# EAGLE design PayloadStandingV25 (EAGLE 9.0.0)
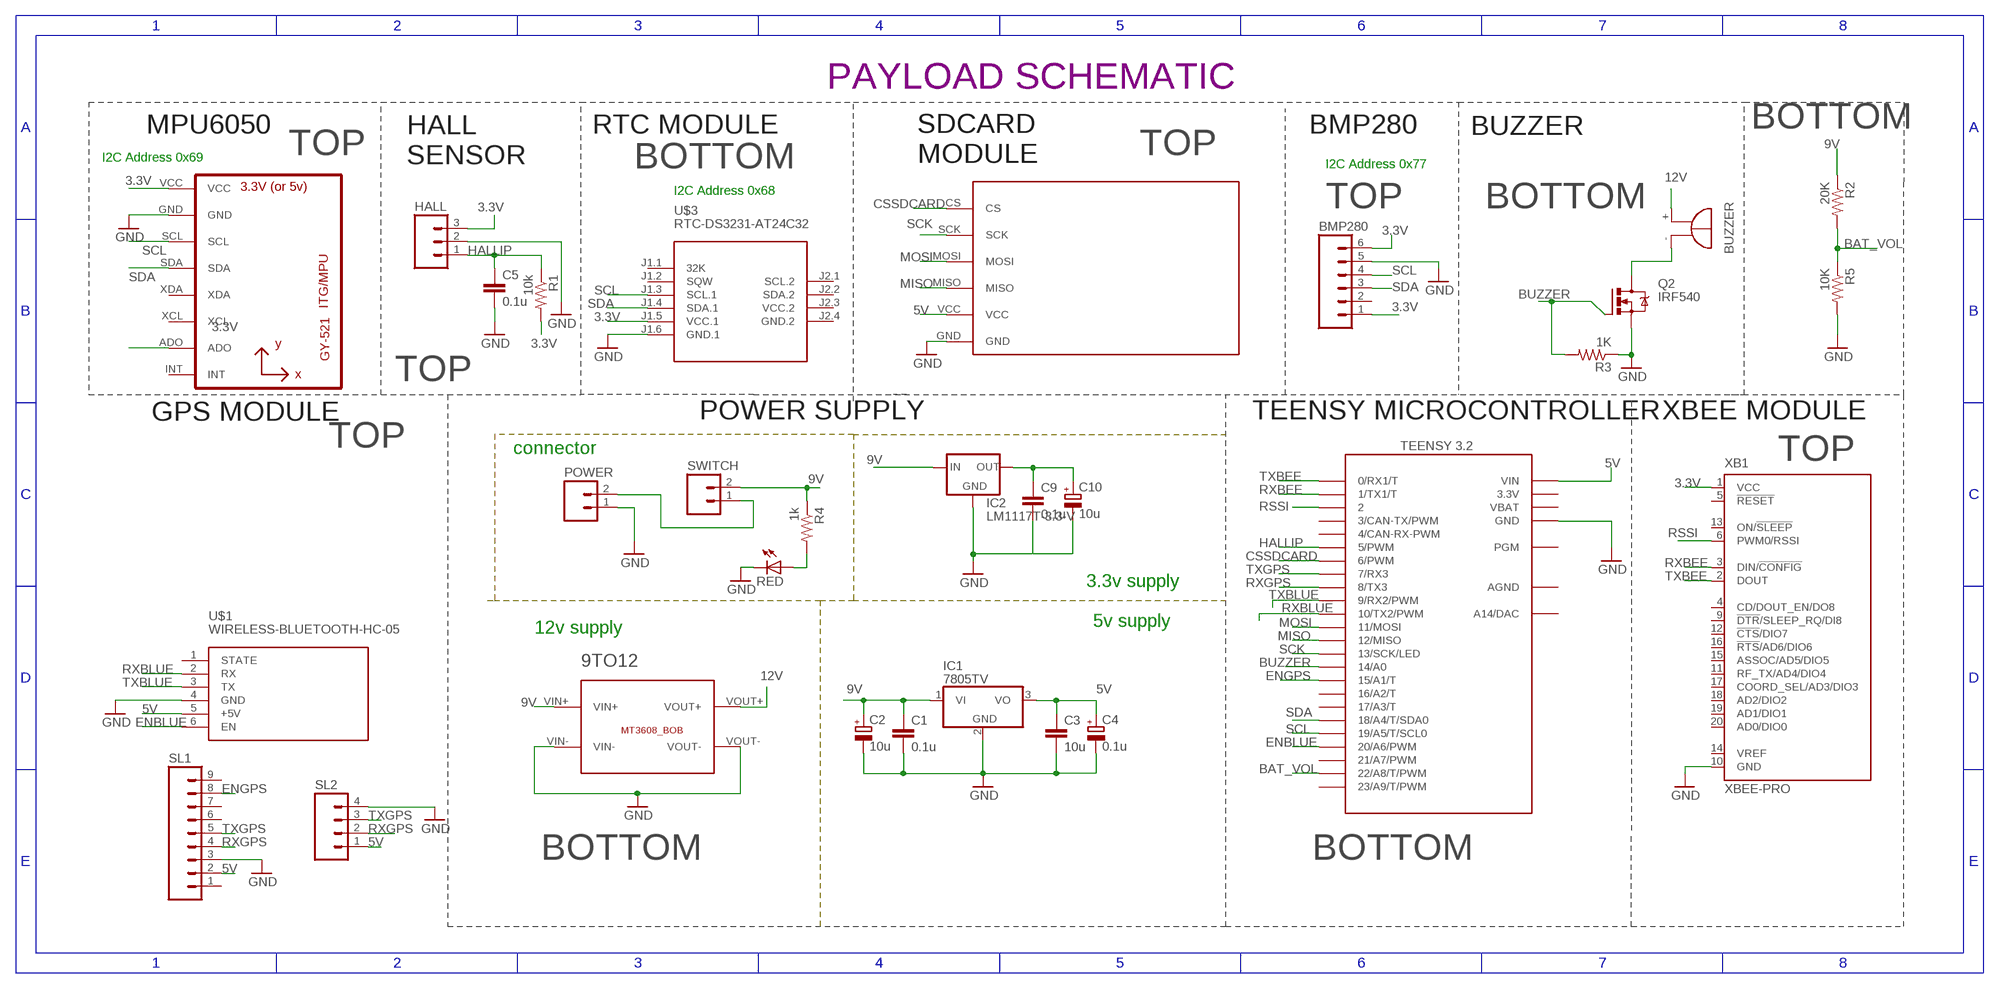
[diagram p0: schematic, sheet 1]

## Parts
9TO12  BREAKOUTS_MT3608_BOB  [BREAKOUTS_MT3608_BOB]
BMP280  M06  [06P]
C1  0.1u  C-EU025-025X050  [C025-025X050]
C2  10u  CPOL-EUE2.5-6  [E2,5-6]
C3  10u  C-EU025-025X050  [C025-025X050]
C4  0.1u  CPOL-EUE2.5-6  [E2,5-6]
C5  0.1u  C-EU025-025X050  [C025-025X050]
C9  0.1u  C-EU025-025X050  [C025-025X050]
C10  10u  CPOL-EUE2.5-6  [E2,5-6]
HALL  M03  [03P]
IC1  7805TV  [TO220V]
IC2  LM1117T-3.3-V  [TO220V]
POWER  CEDT_JANUARY_2015_V5_M02  [CEDT_JANUARY_2015_V5_02P]
Q2  IRF540  [TO220BV]
R1  10k  R-US_0204/7  [0204/7]
R2  20K  R-US_0204/7  [0204/7]
R3  1K  R-US_0204/7  [0204/7]
R4  1k  R-US_0204/7  [0204/7]
R5  10K  R-US_0204/7  [0204/7]
RED  red  LED3MM  [LED3MM]
SG1  BUZZER_EB2209A  [BUZZER_EB2209A]
SL1  M09  [09P]
SL2  CON-AMP-QUICK_M04  [CON-AMP-QUICK_04P]
SWITCH  M02  [02P]
U1  GY-521MPU6050  [GY-521]
U$1  WIRELESS-BLUETOOTH-HC-05  [WIRELESS-BLUETOOTH-HC-05]
U$2  TEENSY_3.1-3.2_OUTER_ROW  [TEENSY_3.0-3.2&LC_OUTER_ROW]
U$3  RTC-DS3231-AT24C32  [RTC-DS3231-AT24C32]
U$5  SDCARD  [M0SDCARDMODULE]
XB1  XBEE-PRO  [XBEE-PRO]

## Nets
3.3V [power]: BMP280.1 BMP280.6 C9.1 C10.+ HALL.3 IC2.2(OUT) R1.2 U1.ADO U1.VCC U$3.J1.5(VCC.1) XB1.1(VCC)
5V [power]: C3.1 C4.+ IC1.3(VO) SL1.2 SL2.1 U$1.5(+5V) U$2.VIN U$5.VCC
9V [power]: 9TO12.VIN+ C1.1 C2.+ IC1.1(VI) IC2.3(IN) R2.1 R4.1 SWITCH.2
12V [power]: 9TO12.VOUT+ SG1.+
BAT_VOL: R2.2 R5.1 U$2.22/A8(22/A8/T/PWM)
BUZZER: Q2.G R3.2 U$2.14/A0
CSSDCARD: U$2.6(6/PWM) U$5.CS
ENBLUE: U$1.6(EN) U$2.20/A6(20/A6/PWM)
ENGPS: SL1.8 U$2.15/A1(15/A1/T)
GND [power]: 9TO12.VIN- 9TO12.VOUT- BMP280.5 C1.2 C2.- C3.2 C4.- C5.2 C9.2 C10.- HALL.2 IC1.2(GND) IC2.1(GND) POWER.1 Q2.S R3.1 R5.2 RED.K(C) SL1.3 SL2.4 U1.GND U$1.4(GND) U$2.GND U$2.GND1(GND) U$3.J1.6(GND.1) U$5.GND XB1.10(GND)
HALLIP: C5.1 HALL.1 R1.1 U$2.5(5/PWM)
MISO: U$2.12(12/MISO) U$5.MISO
MOSI: U$2.11(11/MOSI) U$5.MOSI
N$1 [power]: POWER.2 SWITCH.1
N$2: R4.2 RED.A
N$3 [power]: Q2.D SG1.-
RSSI: U$2.2 XB1.6(PWM0/RSSI)
RXBEE: U$2.1(1/TX1/T) XB1.3(DIN/!CONFIG)
RXBLUE: U$1.2(RX) U$2.10(10/TX2/PWM)
RXGPS: SL1.4 SL2.2 U$2.8(8/TX3)
SCK: U$2.13(13/SCK/LED) U$5.SCK
SCL: BMP280.4 U1.SCL U$2.19/A5(19/A5/T/SCL0) U$3.J1.3(SCL.1)
SDA: BMP280.3 U1.SDA U$2.18/A4(18/A4/T/SDA0) U$3.J1.4(SDA.1)
TXBEE: U$2.0(0/RX1/T) XB1.2(DOUT)
TXBLUE: U$1.3(TX) U$2.9(9/RX2/PWM)
TXGPS: SL1.5 SL2.3 U$2.7(7/RX3)
Unconnected: BMP280.2 SL1.1 SL1.6 SL1.7 SL1.9 U1.INT U1.XCL U1.XDA U$1.1(STATE) U$2.3(3/CAN-TX/PWM) U$2.4(4/CAN-RX-PWM) U$2.16/A2(16/A2/T) U$2.17/A3(17/A3/T) U$2.21/A7(21/A7/PWM) U$2.23/A9(23/A9/T/PWM) U$2.PGM U$2.RESET/DAC(A14/DAC) U$3.J1.1(32K) U$3.J1.2(SQW) U$3.J2.1(SCL.2) U$3.J2.2(SDA.2) XB1.4(CD/DOUT_EN/DO8) XB1.5(!RESET) XB1.9(!DTR!/SLEEP_RQ/DI8) XB1.11(RF_TX/AD4/DIO4) XB1.12(!CTS!/DIO7) XB1.13(ON/!SLEEP) XB1.14(VREF) XB1.15(ASSOC/AD5/DIO5) XB1.16(!RTS!/AD6/DIO6) XB1.17(COORD_SEL/AD3/DIO3) XB1.18(AD2/DIO2) XB1.19(AD1/DIO1) XB1.20(AD0/DIO0)

## Notes on the sheet
- PAYLOAD SCHEMATIC
- MPU6050 | RTC MODULE | BMP280 | BUZZER | BOTTOM
- TOP | TOP
- I2C Address 0x69
- SDCARD
  MODULE
- HALL
  SENSOR
- BOTTOM | I2C Address 0x77
- I2C Address 0x68
- TOP | BOTTOM
- TOP
- GPS MODULE | POWER SUPPLY | TEENSY MICROCONTROLLER | XBEE MODULE
- TOP
- connector
- TOP
- 3.3v supply
- 5v supply
- 12v supply
- BOTTOM | BOTTOM

## Power pins joined to a net without a drawn wire
3.3V: U$2.3.3V U$2.3.3V1(3.3V)
AGND: U$2.AGND
GND.2: U$3.J2.4(GND.2)
VBAT: U$2.VBAT
VCC.2: U$3.J2.3(VCC.2)

## Library data of the parts
9TO12 = Cansat2019_3279_Container_v01:BREAKOUTS_MT3608_BOB
BMP280 = con-amp-quick:M06: AMP QUICK CONNECTOR; OC_FARNELL: unknown; OC_NEWARK: unknown
C1 C3 C5 C9 = resistor:C-EU: CAPACITOR, European symbol
C2 C4 C10 = rcl:CPOL-EU: POLARIZED CAPACITOR, European symbol; SPICEPREFIX: C
HALL = con-amp-quick:M03: AMP QUICK CONNECTOR; OC_FARNELL: unknown; OC_NEWARK: unknown
IC1 = linear:78*: Positive VOLTAGE REGULATOR Source: http://cache.national.com/ds/LM/LM78L05.pdf http://www.fairchildsemi.com/ds/LM/LM7805.pdf
IC2 = lm1117:LM1117T-*
POWER = Cansat2019_3279_Container_v01:CEDT_JANUARY_2015_V5_M02: AMP QUICK CONNECTOR
Q2 = transistor-power:IRF540: HEXFET Power MOSFET
R1-R5 = rcl:R-US_: RESISTOR, American symbol; SPICEPREFIX: R
RED = CEDT_JANUARY_2015_v5:LED
SG1 = Cansat2019_3279_Container_v01:BUZZER_EB2209A: BUZZER Source: Buerklin; OC_FARNELL: unknown; OC_NEWARK: unknown
SL1 = con-amp-quick:M09: AMP QUICK CONNECTOR; OC_FARNELL: unknown; OC_NEWARK: unknown
SL2 = ADC_CPLDV8:CON-AMP-QUICK_M04: AMP QUICK CONNECTOR; OC_FARNELL: unknown; OC_NEWARK: unknown
SWITCH = CEDT_JANUARY_2015_v5:M02: AMP QUICK CONNECTOR
U1 = gy-521:GY-521
U$1 = diy-modules(1):WIRELESS-BLUETOOTH-HC-05: Bluetooth Transceiver Module based on HC-05 board Tutorial is available here: https://arduino-info.wikispaces.com/BlueTooth-HC05-HC06-Modules-How-To Click here to find device on ebay.com <http://www.ebay.com/sch/hc-05+module+rs232>
U$2 = Teensy_3_and_LC_Series_Boards_v1.4:TEENSY_3.1-3.2_OUTER_ROW: Footprint for Teensy 3.1 or 3.2 board using all pin connections on the outer perimeter
U$3 = diy-modules:RTC-DS3231-AT24C32: RTC Module with Battery and EEPROM based on DS3231 and AT24C32 chips Tutorial can be found here: https://edwardmallon.wordpress.com/2014/05/21/using-a-cheap-3-ds3231-rtc-at24c32-eeprom-from-ebay/ Click here to find device on ebay.com <http://www.ebay.com/sch/DS3231+AT24C32+module>
U$5 = mylib:SDCARD
XB1 = maxstream:XBEE: XBee (TM) /XBee-PRO(TM) OEM RF Modules Source: MaxStream, Inc. xbee_productmanual.pdf; MPN: XBP24-AWI-001; OC_FARNELL: 1337916; OC_NEWARK: 42M2667

## Net classes
0 default: width 0.61 mm
1 power: width 0.61 mm

## Board
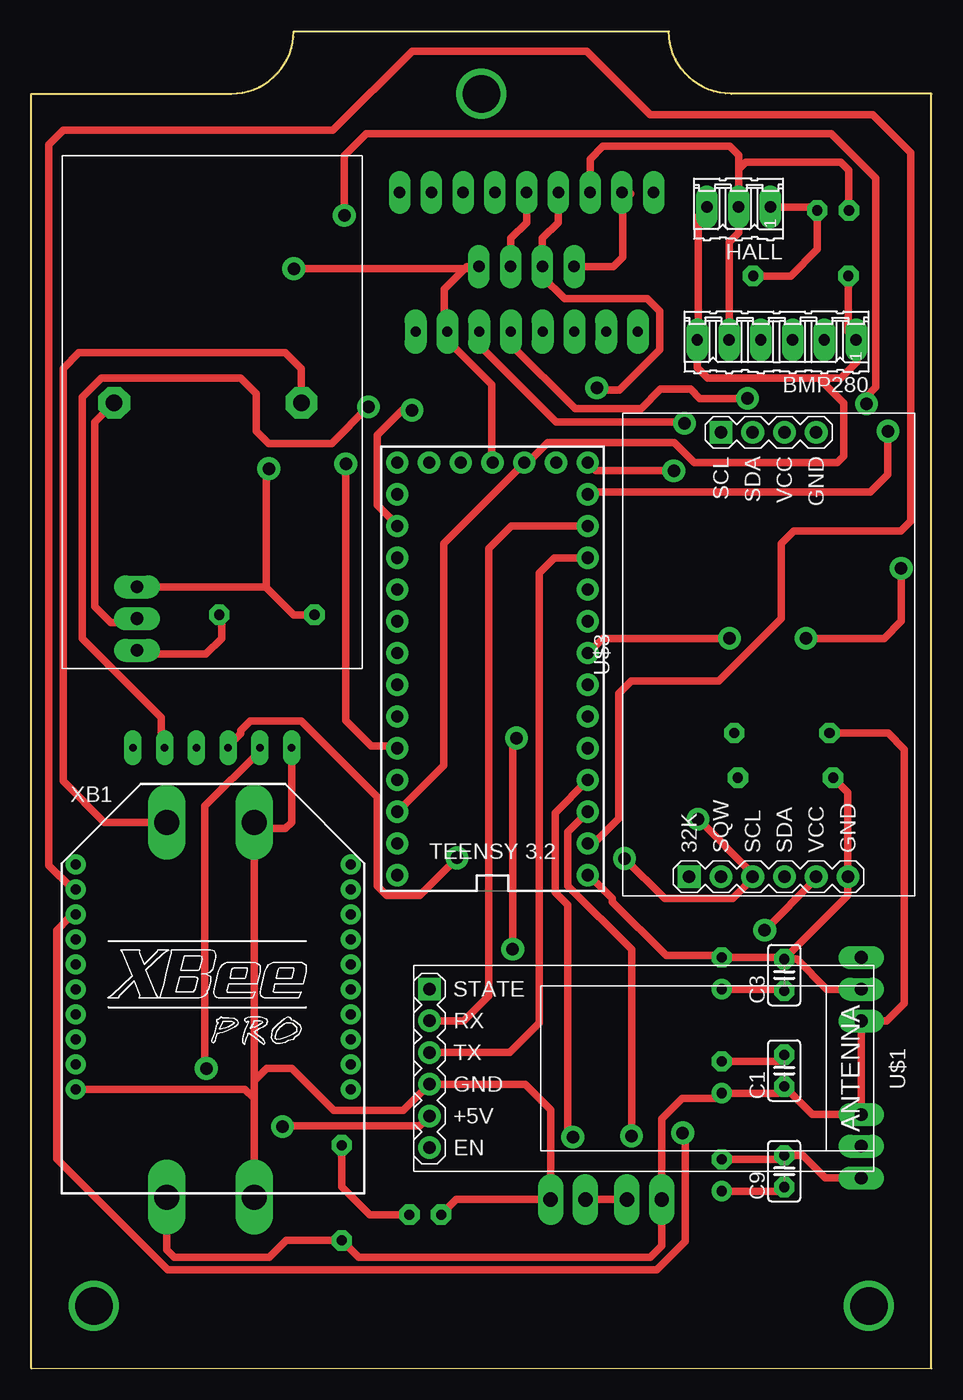
[diagram p1: board, top side]
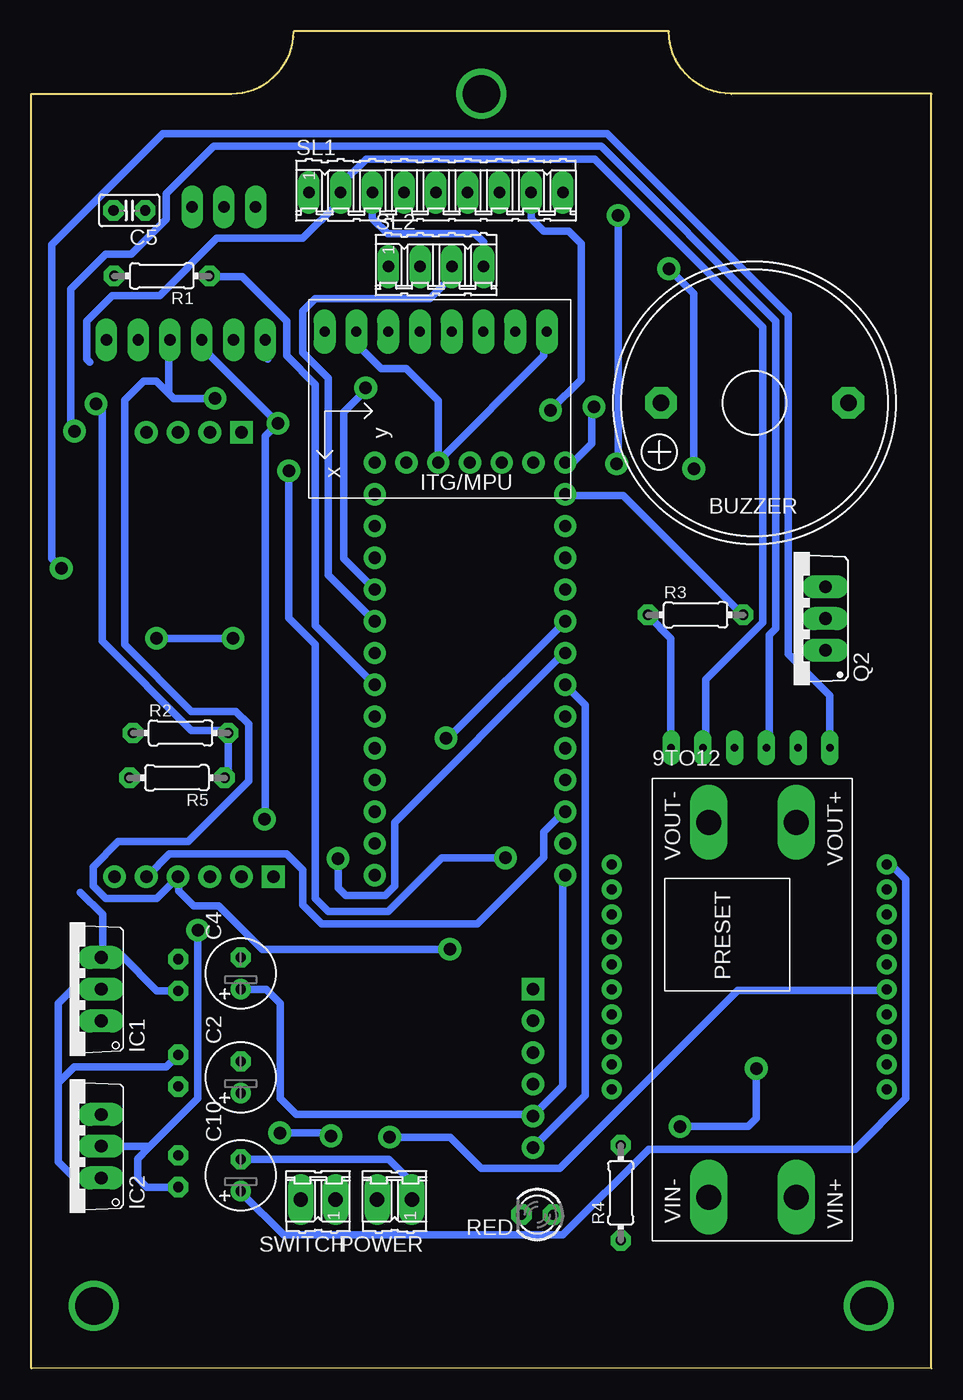
[diagram p2: board, bottom side, seen from below]

Size 72 x 107 mm. Coordinates in mm from the lower left corner, seen from the top.
Outline: 0,0 72,0 72,102 56,102 arc-90 51,107 21,107 arc-90 16,102 0,102 0,0
Copper layers (1*16): Top 0.035mm / dielectric 1.5mm / Bottom 0.035mm
Design rules "default *": minimum track width 6mil, minimum drill 0.35mm, track to track 16mil, track to pad 16mil, pad to pad 16mil, via to via 16mil, smd to smd 6mil, copper to edge 40mil, drill to drill 6mil, minimum pad ring 16mil, minimum via ring 16mil, stop-mask expansion 4mil, vias tented up to drill 0mil, thermal gap 10mil

### Footprints (pad centres in the part's own frame; a part is rotated, then mirrored left to right if it is on the bottom)
BREAKOUTS_MT3608_BOB = drill 2 pad 3 long: VIN+ 33.5,-4.5; VIN- 33.5,-11.5; VOUT+ 3.5,-4.5; VOUT- 3.5,-11.5
06P = drill 0.914 long: 1 -6.35,0; 2 -3.81,0; 3 -1.27,0; 4 1.27,0; 5 3.81,0; 6 6.35,0
C025-025X050 = drill 0.813 octagon: 1 -1.27,0; 2 1.27,0
E2,5-6 = drill 0.813 pad 1.6: + -1.27,0 | drill 0.813 pad 1.6 octagon: - 1.27,0
03P = drill 0.914 long: 1 -2.54,0; 2 0,0; 3 2.54,0
TO220V = drill 1.016 long: 1 -2.54,-2.54; 2 0,-2.54; 3 2.54,-2.54
CEDT_JANUARY_2015_V5_02P = drill 1.143 long: 1 -1.397,0; 2 1.397,0
TO220BV = drill 1.016 long: D 0,-2.54; G -2.54,-2.54; S 2.54,-2.54
0204/7 = drill 0.813 octagon: 1 -3.81,0; 2 3.81,0
LED3MM = drill 0.813 octagon: A -1.27,0; K 1.27,0
BUZZER_EB2209A = drill 1.321 pad 2.54 octagon: + 7.493,0; - -7.493,0
09P = drill 0.914 long: 1 -10.16,0; 2 -7.62,0; 3 -5.08,0; 4 -2.54,0; 5 0,0; 6 2.54,0; 7 5.08,0; 8 7.62,0; 9 10.16,0
CON-AMP-QUICK_04P = drill 0.914 long: 1 -3.81,0; 2 -1.27,0; 3 1.27,0; 4 3.81,0
02P = drill 1.143 long: 1 -1.397,0; 2 1.397,0
GY-521 = drill 0.8 pad 1.778 long: ADO -8.89,-6.35; GND -8.89,6.35; INT -8.89,-8.89; SCL -8.89,3.81; SDA -8.89,1.27; VCC -8.89,8.89; XCL -8.89,-3.81; XDA -8.89,-1.27
WIRELESS-BLUETOOTH-HC-05 = drill 1 square: 1 -6.35,-17.145 | drill 1: 2 -3.81,-17.145; 3 -1.27,-17.145; 4 1.27,-17.145; 5 3.81,-17.145; 6 6.35,-17.145
TEENSY_3.0-3.2&LC_OUTER_ROW = drill 0.965: 0 -7.62,13.97; 1 -7.62,11.43; 2 -7.62,8.89; 3 -7.62,6.35; 3.3V 7.62,11.43; 3.3V1 -2.54,-16.51; 4 -7.62,3.81; 5 -7.62,1.27; 6 -7.62,-1.27; 7 -7.62,-3.81; 8 -7.62,-6.35; 9 -7.62,-8.89; 10 -7.62,-11.43; 11 -7.62,-13.97; 12 -7.62,-16.51; 13 7.62,-16.51; 14/A0 7.62,-13.97; 15/A1 7.62,-11.43; 16/A2 7.62,-8.89; 17/A3 7.62,-6.35; 18/A4 7.62,-3.81; 19/A5 7.62,-1.27; 20/A6 7.62,1.27; 21/A7 7.62,3.81; 22/A8 7.62,6.35; 23/A9 7.62,8.89; AGND 7.62,13.97; GND -7.62,16.51; GND1 0,-16.51; PGM 2.54,-16.51; RESET/DAC 5.08,-16.51; VBAT -5.08,-16.51; VIN 7.62,16.51
RTC-DS3231-AT24C32 = drill 1 square: J1.1 -17.78,6.35; J2.1 17.78,3.81 | drill 1: J1.2 -17.78,3.81; J1.3 -17.78,1.27; J1.4 -17.78,-1.27; J1.5 -17.78,-3.81; J1.6 -17.78,-6.35; J2.2 17.78,1.27; J2.3 17.78,-1.27; J2.4 17.78,-3.81
M0SDCARDMODULE = drill 0.6 long: CS -6.35,6.35; GND -6.35,-6.35; MISO -6.35,-1.27; MOSI -6.35,1.27; SCK -6.35,3.81; VCC -6.35,-3.81
XBEE-PRO = drill 0.8 pad 1.27: 1 -11,9; 2 -11,7; 3 -11,5; 4 -11,3; 5 -11,1; 6 -11,-1; 7 -11,-3; 8 -11,-5; 9 -11,-7; 10 -11,-9; 11 11,-9; 12 11,-7; 13 11,-5; 14 11,-3; 15 11,-1; 16 11,1; 17 11,3; 18 11,5; 19 11,7; 20 11,9

### Placement (x,y rotation side)
9TO12  6.32,47.2 270 bottom
BMP280  59.63,82.29 180 top
C1  60.24,23.82 90 top
C2  55.24,23.29 90 bottom
C3  60.24,31.47 90 top
C4  55.24,31.61 90 bottom
C5  64.15,92.66 180 bottom
C9  60.24,15.77 90 top
C10  55.24,15.45 90 bottom
HALL  56.59,92.93 180 top
IC1  68.94,30.34 90 bottom
IC2  68.94,17.77 90 bottom
POWER  42.94,13.51 180 bottom
Q2  11,60 90 bottom
R1  61.56,87.42 180 bottom
R2  60.05,50.84 0 bottom
R3  18.85,60.3 0 bottom
R4  24.84,14.04 90 bottom
R5  60.34,47.26 180 bottom
RED  31.52,12.29 180 bottom
SG1  14.13,77.26 180 bottom
SL1  39.62,94.11 0 bottom
SL2  39.62,88.16 0 bottom
SWITCH  49.05,13.51 180 bottom
U1  39.63,74.08 270 bottom
U$1  49,24 270 top
U$2  36.91,55.97 180 top
U$3  58.99,57.12 90 top
U$5  14.47,56.02 90 top
XB1  14.55,31.32 0 top

### Tracks (layer width: path | path; a pad name or v marks a point on that pad's centre or on a via)
3.3V  (via drill 1)
  Top 0.61: R1.2 65.37,82.9 BMP280.1 66.04,82.23 66.04,80.51 64.77,79.24 63,79.24 | HALL.3 53.34,92.22 53.34,82.35 BMP280.6 53.28,80.07 54.11,79.24 63,79.24 | C10.+ 59.92,14.18 C9.1 | 29.46,44.7 U$2.3.3V 33,48.25 33,66 39.45,72.45 U$2.3.3V1 | 39.37,72.39 U$2.3.3V1 | v58.67,35.05 62.74,39.12 U$3.J1.5 | U$2.3.3V1 39.72,72.48 41.32,74.08 51.44,74.08 53.04,72.48 64.48,72.48 65,73 65,77.24 63,79.24
  Bottom 0.61: C9.1 62.76,14.5 63.5,15.24 63.5,16.76 62.63,17.63 | 64.77,17.78 IC2.2 62.77,17.77 62.63,17.63 | XB1.1 3.3,40.13 3.05,40.13 2.03,39.12 2.03,21.59 6.1,17.53 22.61,17.53 29.46,10.67 51.82,10.67 55.12,13.97 C10.+ | U1.VCC 30.99,82.8 30.99,81.03 39.37,72.64 U$2.3.3V1 39.45,77.45 42,80 44,80 45.97,81.97 45.97,82.8 U1.ADO | U$3.J1.5 62.74,39.37 60.96,41.15 51.56,41.15 50.29,39.88 50.29,37.08 48.77,35.56 36.32,35.56 30.99,40.89 30.99,42.93 29.46,44.45 U$2.3.3V | 53.09,80.77 53.09,82.04 BMP280.6 | v58.67,35.05 58.67,21.59 62.63,17.63
5V  (via drill 1)
  Top 0.61: SL2.1 46.57,88.16 47.31,88.9 47.31,93.34 47.94,93.98 47.82,94.11 SL1.2 | C4.+ 60.1,30.34 C3.1 | U$1.5 31.07,19.4 20.1,19.4 v20.1,19.34 | U$5.VCC 18.28,49.38 13.9,45 13.9,24.1 v14,24
  Bottom 0.61: C3.1 61.95,30.2 64.77,33.02 66.26,33.02 IC1.3 66.29,33.27 66.29,36.32 68.07,38.1 | C4.+ 53.2,30.34 52.07,29.21 52.07,21.59 50.8,20.32 31.98,20.32 U$1.5 31.75,20.32 29.46,22.61 29.46,39.37 U$2.VIN | U$5.VCC 18.03,49.78 18.03,55.12 13.46,59.69 13.46,83.31 26.92,96.77 45.21,96.77 47.24,94.74 SL1.2 47.5,93.98 47.5,93.22 50.29,90.42 57.15,90.42 61.72,85.85 65.53,85.85 67.56,83.82 67.56,80.77 67.31,80.52 | v14,24 14,20 14.65,19.34 v20.1,19.34
9V
  Top 0.61: 9TO12.VIN+ 10.82,9.5 11.43,8.89 19.05,8.89 20.39,10.23 R4.1 26.18,8.89 49.53,8.89 50.45,9.81 SWITCH.2 50.45,19.97 52.07,21.59 54.81,21.59 C2.+ 59.71,22.02 C1.1 62.48,20.31 IC2.3 IC1.1 68.44,27.8 69.85,29.21 69.85,49.53 68.54,50.84 R2.1
12V
  Top 0.61: SG1.+ 21.59,77.29 21.59,80.01 20.32,81.28 3.81,81.28 2.54,80.01 2.54,46.99 5.83,43.7 9TO12.VOUT+
BAT_VOL  (via drill 1)
  Top 0.61: U$2.22/A8 29.21,49.78 27.22,49.78 25.16,51.84 v25.16,72.37 | v25.05,92.26 25.05,97.05 26.81,98.81 64.01,98.81 67.56,95.25 67.56,78.5 66.83,77.77 v66.83,77.17
  Bottom 0.61: R5.1 56.24,47.55 R2.2 56.39,51.05 59.18,51.05 66.33,58.2 66.33,76.67 v66.83,77.17 | v25.16,72.37 25.05,72.49 v25.05,92.26
BUZZER
  Top 0.61: Q2.G 8.77,57.15 13.97,57.15 15.24,58.42 15.24,60.1 R3.2
  Bottom 0.61: U$2.14/A0 29.21,69.85 24.64,69.85 15.24,60.45 R3.2
CSSDCARD  (via drill 1)
  Top 0.61: v55.86,58.42 45.72,58.42 44.7,57.4 U$2.6 | v61.99,58.42 68.22,58.42 69.6,59.8 v69.6,64.02
  Bottom 0.61: v55.86,58.42 v61.99,58.42 | U$5.CS 8.13,49.78 8.13,53.85 11.43,57.15 11.43,84.33 25.91,98.81 61.47,98.81 70.36,89.92 70.36,64.79 v69.6,64.02
ENBLUE
  Bottom 0.61: U$2.20/A6 29.21,54.61 27.69,53.09 27.69,21.84 31.75,17.78 U$1.6
ENGPS  (via drill 1)
  Top 0.61: U$2.15/A1 29.21,67.56 27.69,69.09 27.69,74.69 29.68,76.68 v30.46,76.68
  Bottom 0.61: v30.46,76.68 28,79.14 28,90 29,91 31,91 32,92 SL1.8
GND  (via drill 1)
  Top 0.61: SL1.3 44.7,96.77 45.72,97.79 55.88,97.79 56.59,97.08 56.59,95.96 | 56.59,95.96 HALL.2 56.59,90.88 55.82,90.11 BMP280.5 | 56.59,95.96 57.15,96.52 64.77,96.52 65.41,95.89 65.41,92.67 C5.2 | U$5.GND 20.82,43.68 20.32,43.18 17.78,43.18 17.82,43.22 9TO12.VOUT- 17.82,23 | 17.82,23 17.82,21.59 | 17.82,21.59 9TO12.VIN- | XB1.10 17.09,22.32 17.82,21.59 | RED.K 34.01,13.51 POWER.1 41.54,20.69 39.5,22.73 U$1.4 29.77,20.64 24.21,20.64 20.85,24 18.82,24 17.82,23 | C10.- 59.92,16.72 C9.2 61.7,17.04 63.51,15.23 IC2.1 | C2.- 59.71,24.56 C1.2 | C3.2 60.1,32.88 C4.- 55.12,33.02 50.8,33.02 46.48,37.34 46.48,37.59 44.7,39.37 U$2.GND | C3.2 61.24,32.74 63.64,30.34 IC1.2 | R5.2 65.34,46.07 U$3.J1.6 65.34,37.84 C3.2 | Q2.S 18.74,62.54 | R3.1 20.98,60.3 18.74,62.54 | U$2.GND1 36.83,72.64 36.83,78.74 33.53,82.04 33.53,82.8 U1.GND 33.02,83.23 33.02,86.36 34.82,88.16 SL2.4 35.65,88 v21,88 | 18.74,62.54 18.8,62.74 18.8,71.8 v19,72
  Bottom 0.61: SL2.4 35.81,90.11 36.51,90.81 43.5,90.81 44.7,92.01 SL1.3 | IC1.2 68.72,30.34 69.85,29.21 69.85,22.86 | 69.85,22.86 69.85,16.51 68.57,15.23 IC2.1 | C1.2 61.2,24.13 68.58,24.13 69.85,22.86 | C10.- 43.39,16.72 41.54,14.87 POWER.1 | U$5.GND 20.83,49.78 20.83,58.42 22.61,60.2 R3.1 | v19,72 19,86 v21,88
HALLIP
  Top 0.61: R1.1 60.75,87.42 62.88,89.55 C5.1 62.61,92.93 HALL.1
  Bottom 0.61: U$2.5 44.7,54.86 49.28,59.44 49.28,78.74 51.56,81.03 51.56,83.82 55.12,87.38 57.66,87.38 R1.1
MISO  (via drill 1)
  Top 0.61: U$5.MISO 15.75,49.78 16.76,50.8 16.76,51.05 17.53,51.82 21.59,51.82 27.69,45.72 27.69,38.61 28.45,37.85 31.07,37.85 v34.07,40.85 | 44.7,72.39 U$2.12 45.18,71.83 v51.4,71.83
  Bottom 0.61: v51.4,71.83 51.4,60.04 49.28,57.91 49.28,37.59 48.26,36.58 43.43,36.58 39.16,40.85 v34.07,40.85
MOSI  (via drill 1)
  Top 0.61: 68.53,74.49 v68.53,74.99 68.53,71.53 67.1,70.1 44.7,70.1 U$2.11
  Bottom 0.61: U$5.MOSI 12.95,49.78 12.95,58.67 12.45,59.18 12.45,83.82 26.42,97.79 57.4,97.79 61.21,93.98 61.21,91.95 64.01,89.15 66.04,89.15 68.83,86.36 68.83,75.29 v68.53,74.99
N$1
  Top 0.61: POWER.2 SWITCH.1
N$2
  Top 0.61: R4.2 24.84,14.53 27.08,12.29 RED.A
N$3
  Top 0.61: SG1.- 5.08,75.7 5.08,60.96 6.35,59.69 8.15,59.69 Q2.D
N$4  (via drill 3)
  other vias: 67,5
N$5  (via drill 3)
  other vias: 5,5
N$6  (via drill 3)
  other vias: 36,102
RSSI  (via drill 1)
  Top 0.61: U$2.2 44.45,46.99 41.91,44.45 41.91,38.1 42.93,37.08 42.93,18.9 v43.33,18.5
  Bottom 0.61: XB1.6 3.56,30.23 15.49,30.23 29.72,16 36,16 38.5,18.5 v43.33,18.5
RXBEE  (via drill 1)
  Top 0.61: XB1.3 3.3,36.07 3.05,36.07 2.03,35.05 2.03,16.76 10.92,7.87 50.04,7.87 52.32,10.16 52.32,18.63 v52.12,18.83 | U$2.1 44.45,44.45 42.93,42.93 42.93,38.61 48.02,33.51 v48.02,18.6
  Bottom 0.61: v52.12,18.83 48.26,18.83 v48.02,18.6
RXBLUE
  Top 0.61: U$1.2 34.59,27.81 34.6,27.8 36.59,29.79 36.59,65.59 38.4,67.4 U$2.10
RXGPS  (via drill 1)
  Top 0.61: SL1.4 42.16,91.69 40.89,90.42 SL2.2 40.89,87.38 42.67,85.6 49.28,85.6 50.29,84.58 50.29,81.53 47.02,78.26 45.44,78.26 v45.24,78.46
  Bottom 0.61: 44.7,62.48 U$2.8 47,64.79 47,76.51 45.24,78.26 v45.24,78.46
SCK  (via drill 1)
  Top 0.61: U$5.SCK 10.41,49.78 10.41,52.07 4.06,58.42 4.06,77.72 5.59,79.25 16.76,79.25 18,78.01 18,75 19,74 24.02,74 v26.97,76.95
  Bottom 0.61: U$2.13 29.21,72.64 28.53,72.64 27.18,74 27.18,76.74 v26.97,76.95
SCL  (via drill 1)
  Top 0.61: 36.07,82.04 36.07,82.8 U1.SCL 35.82,81.88 42,75.7 52.19,75.7 v52.27,75.62 | v53.34,43.94 57.66,39.62 U$3.J1.3 57.66,39.12 56.13,37.59 50.66,37.59 v47.45,40.8
  Bottom 0.61: 58.17,81.53 58.17,82.04 BMP280.4 58.36,81.71 v52.27,75.62 53.3,74.59 53.3,43.98 v53.34,43.94 | U$2.19/A5 29.46,57.15 42.93,43.69 42.93,38.61 43.69,37.85 46.85,37.85 47.45,38.45 v47.45,40.8
SDA  (via drill 1)
  Top 0.61: 38.61,82.04 38.61,82.8 U1.SDA 38.36,81.94 43.5,76.8 48.78,76.8 50.33,78.34 52.74,78.34 53.47,77.62 v57.29,77.62 | v38.52,33.54 38.52,50.14 v38.82,50.44
  Bottom 0.61: 60.71,81.53 60.71,82.04 | 60.71,82.04 BMP280.3 | 29.46,59.69 U$2.18/A4 38.63,50.44 v38.82,50.44 | v57.29,77.62 60.62,77.62 61,78 | 61,78 61,81.75 60.71,82.04 | 61,78 62,79 63,79 64.52,77.48 64.52,57.91 59.18,52.58 55.63,52.58 54.61,51.56 54.61,46.99 59.44,42.16 65.02,42.16 67.06,40.13 67.06,38.61 66.04,37.59 61.98,37.59 60.45,39.12 U$3.J1.4 60.2,39.12 60.2,38.2 59,37 57,37 53.54,33.54 v38.52,33.54
TXBEE
  Top 0.61: XB1.2 3.3,38.35 1.4,40.26 1.4,97.92 2.54,99.06 24.13,99.06 30.48,105.41 44.45,105.41 49.53,100.33 67.31,100.33 70.36,97.28 70.36,67.82 69.54,67 61,67 60,66 60,60 55,55 48,55 47,54 47,44 45.16,42.16 44.7,42.16 U$2.0
TXBLUE
  Top 0.61: U$1.3 38.27,25.27 40.64,27.64 40.64,63.64 41.86,64.86 U$2.9
TXGPS
  Top 0.61: SL2.3 38.35,90.42 39.62,91.69 SL1.5
  Bottom 0.61: SL2.3 38.35,87.38 40.13,85.6 49.28,85.6 50.29,84.58 50.29,81.28 48.26,79.25 48.26,63.5 44.7,59.94 U$2.7